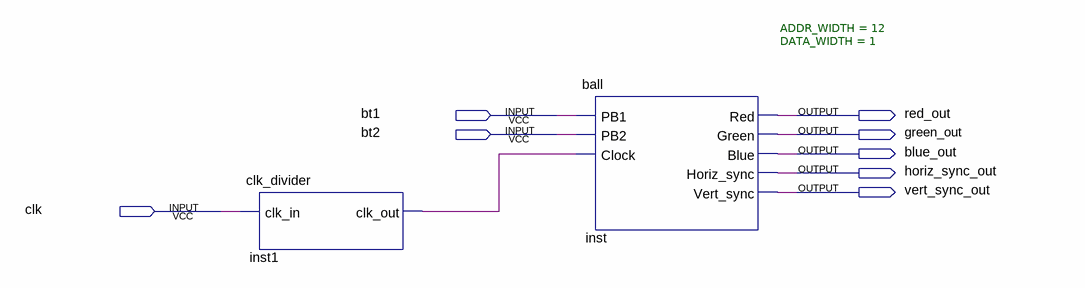
[diagram p0: schematic sheet]
// Quartus schematic Block_bounce.bdf as structural Verilog: 2 symbols, 8 pins
module Block_bounce (
  input  bt1,
  input  bt2,
  input  clk,
  output red_out,
  output green_out,
  output blue_out,
  output horiz_sync_out,
  output vert_sync_out
);

  wire inst1_clk_out;

  clk_divider inst1 (.clk_in(clk), .clk_out(inst1_clk_out));
  ball #(.ADDR_WIDTH(12), .DATA_WIDTH(1)) inst (
    .PB1(bt1), .PB2(bt2), .Clock(inst1_clk_out), .Red(red_out), .Green(green_out), .Blue(blue_out),
    .Horiz_sync(horiz_sync_out), .Vert_sync(vert_sync_out));
endmodule
